# EAGLE design 4-way-charger (EAGLE 7.7.0)
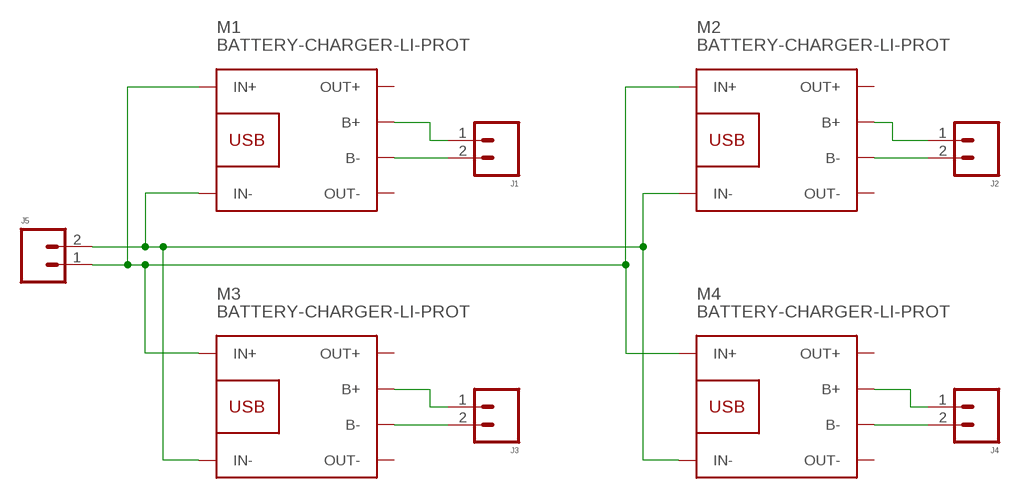
[diagram p0: schematic, sheet 1]

## Parts
J1  M02RA_MALE_MILL  [1X02_RA_PTH_MALE_MILL]
J2  M02RA_MALE_MILL  [1X02_RA_PTH_MALE_MILL]
J3  M02RA_MALE_MILL  [1X02_RA_PTH_MALE_MILL]
J4  M02RA_MALE_MILL  [1X02_RA_PTH_MALE_MILL]
J5  M02RA_MALE_MILL  [1X02_RA_PTH_MALE_MILL]
M1  BATTERY-CHARGER-LI-PROT  [BATTERY-CHARGER-LI-PROT]
M2  BATTERY-CHARGER-LI-PROT  [BATTERY-CHARGER-LI-PROT]
M3  BATTERY-CHARGER-LI-PROT  [BATTERY-CHARGER-LI-PROT]
M4  BATTERY-CHARGER-LI-PROT  [BATTERY-CHARGER-LI-PROT]

## Nets
N$1: J3.2 M3.B-
N$2: J3.1 M3.B+
N$3: J1.2 M1.B-
N$4: J1.1 M1.B+
N$5: J2.2 M2.B-
N$6: J2.1 M2.B+
N$7: J4.2 M4.B-
N$8: J4.1 M4.B+
N$9: J5.2 M1.IN- M2.IN- M3.IN- M4.IN-
N$10: J5.1 M1.IN+ M2.IN+ M3.IN+ M4.IN+
Unconnected: M1.OUT+ M1.OUT- M2.OUT+ M2.OUT- M3.OUT+ M3.OUT- M4.OUT+ M4.OUT-

## Library data of the parts
J1-J5 = micromouse-timer:M02: 2 pin header/connector
M1-M4 = micromouse-timer:BATTERY-CHARGER-LI-PROT: Lithium Battery 5V Charger with protection circuit More details available here: http://www.instructables.com/id/DIY-Lithium-ion-Battery-Charger/step4/TP4056-based-lithium-ion-battery-charger-module/ Click here to find device on ebay.com <http://www.ebay.com/sch/tp4056+charger+usb+protection>

## Net classes
0 default: width 1.27 mm, drill 1 mm, clearance 0.508 mm

## Board
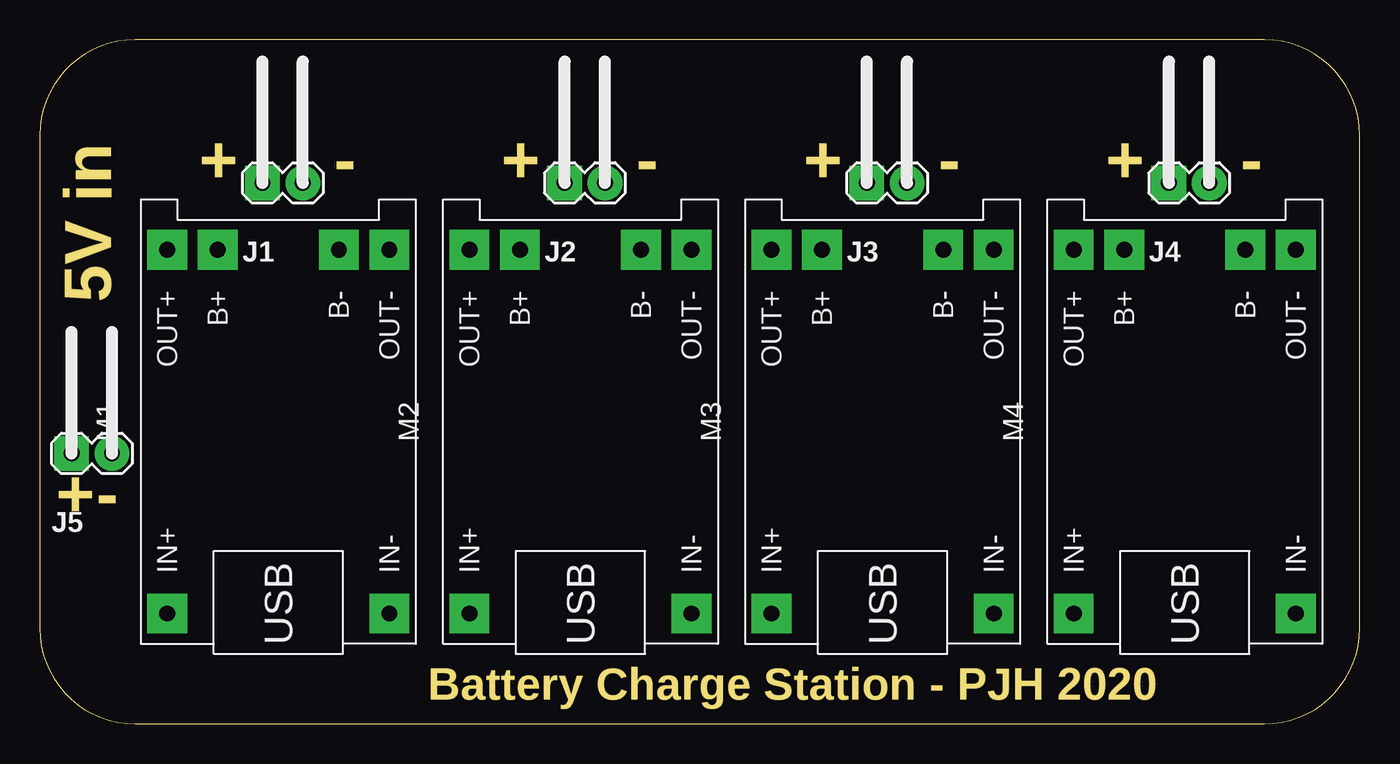
[diagram p1: board, top side]
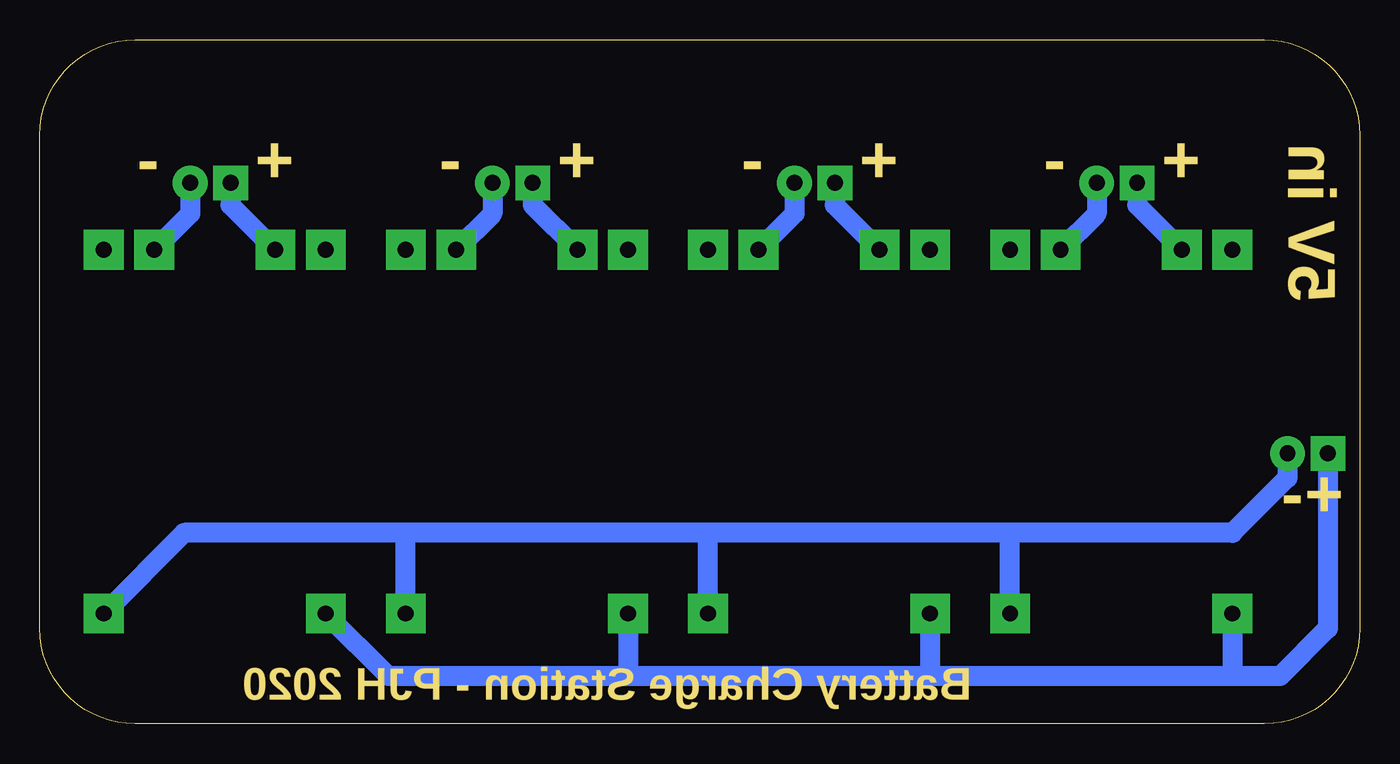
[diagram p2: board, bottom side, seen from below]

Size 83 x 43 mm. Coordinates in mm from the lower left corner, seen from the top.
Outline: 0,37 0,6 arc90 6,0 77,0 arc90 83,6 83,37 arc90 77,43 6,43 arc90 0,37
Copper layers (1*16): Top 0.035mm / dielectric 1.5mm / Bottom 0.035mm
Design rules "milling": minimum track width 10mil, minimum drill 24mil, track to track 20mil, track to pad 20mil, pad to pad 20mil, via to via 20mil, smd to smd 20mil, copper to edge 40mil, drill to drill 20mil, minimum pad ring 10mil, minimum via ring 8mil, stop-mask expansion 4mil, vias tented up to drill 0mil, thermal gap 10mil

### Footprints (pad centres in the part's own frame; a part is rotated, then mirrored left to right if it is on the bottom)
1X02_RA_PTH_MALE_MILL = drill 1 pad 2.184 square: 1 0,0 | drill 1 pad 2.184: 2 2.54,0
BATTERY-CHARGER-LI-PROT = drill 1 pad 2.5 square: B+ 10.795,3.81; B- 10.795,-3.81; IN+ -12.065,6.985; IN- -12.065,-6.985; OUT+ 10.795,6.985; OUT- 10.795,-6.985

### Placement (x,y rotation side)
J1  14,34 0 top
J2  33,34 0 top
J3  52,34 0 top
J4  71,34 0 top
J5  2,17 0 top
M1  15,19 90 top
M2  34,19 90 top
M3  53,19 90 top
M4  72,19 90 top

### Tracks (layer width: path | path; a pad name or v marks a point on that pad's centre or on a via)
N$1
  Bottom 1.27: J3.2 54.54,32.06 M3.B-
N$2
  Bottom 1.27: J3.1 52,32.6 M3.B+
N$3
  Bottom 1.27: J1.2 16.54,32.06 M1.B-
N$4
  Bottom 1.27: J1.1 14,32.6 M1.B+
N$5
  Bottom 1.27: J2.2 35.54,32.06 M2.B-
N$6
  Bottom 1.27: J2.1 33,32.6 M2.B+
N$7
  Bottom 1.27: J4.2 73.54,32.06 M4.B-
N$8
  Bottom 1.27: J4.1 71,32.6 M4.B+
N$9
  Bottom 1.27: M1.IN- 21.98,11.98 | 21.98,11.98 22,12 41,12 | M2.IN- 40.98,11.98 41,12 | J5.2 4.54,15.46 8,12 21.97,12 21.98,11.98 | 41,12 60,12 | 60,12 73.92,12 M4.IN- | M3.IN- 59.98,11.98 60,12
N$10
  Bottom 1.27: J5.1 2,6 5,3 8,3 | 8,3 27,3 | 27,3 46,3 | 46,3 61.08,3 M4.IN+ | M1.IN+ 8.02,3.02 8,3 | M2.IN+ 27.02,3.02 27,3 | M3.IN+ 46.02,3.02 46,3

### Text on the board
Milling: + | - | + | - | + | - | + | - | 5V in | + | - | Battery Charge Station - PJH 2020